# Altium schematic sheet BalEv_ADC_v1_0.SchDoc
size A4; CompanyName: HESSO; Address1: Route du Rawyl 47; Address2: 1950 Sion; Address3: Switzerland; DocumentNumber: 3; SheetNumber: 5; SheetTotal: 8; PageSetup: Record=PageOptions|CenterHorizontal=True|CenterVertical=True|PrintScale=1.00|XCorrection=1.00|YCorrection=1.00|PrintKind=1|BorderSize=5000000|LeftOffset=0|BottomOffset=0|Orientation=2|PaperLength=1000|PaperWidth=1000|Scale=100|PaperSource=15|PrintQuality=1200|MediaType=1|DitherType=10|PrintScaleMode=1|PaperKind=A4|PaperIndex=9; ProjectName: Project Name
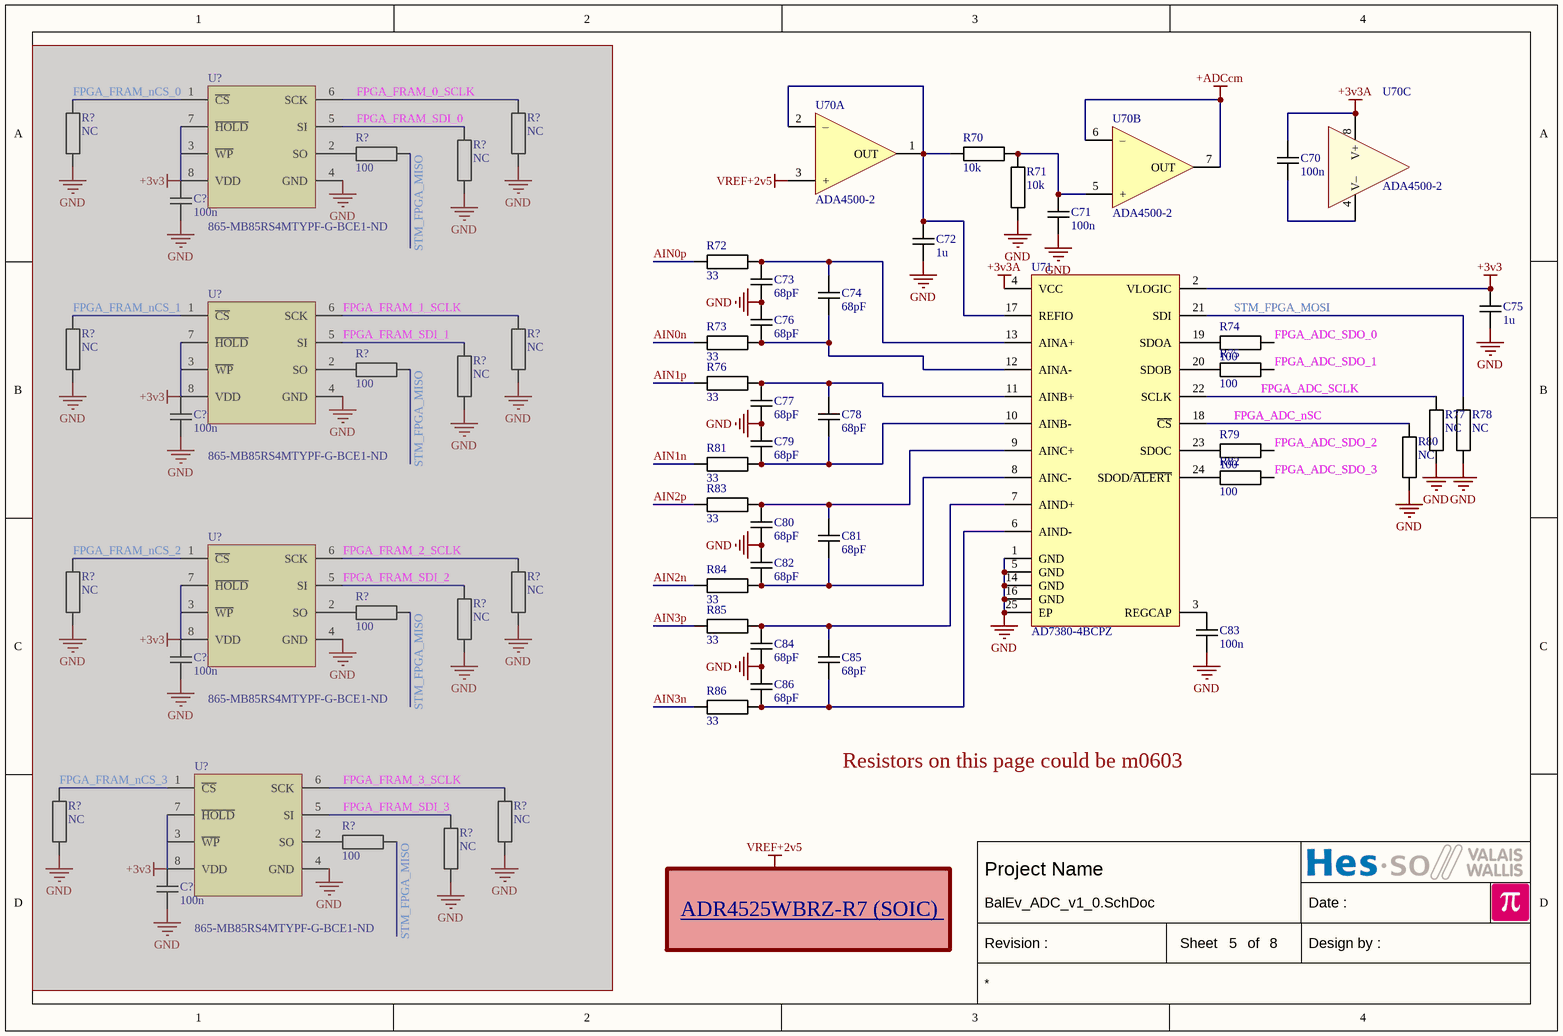
[diagram p0: BalEv_ADC_v1_0.SchDoc]

## Parts
(Parts that share a designator on the sheet are numbered #1, #2 ... from top to bottom, then left to right.)
C70  100n  [CAPACITOR 1005 REFLOW]
C71  100n  [CAPACITOR 1005 REFLOW]
C72  1u  [CAPACITOR 1005 REFLOW]
C73  68pF  [CAPACITOR 1005 REFLOW]
C74  68pF  [CAPACITOR 1005 REFLOW]
C75  1u  [CAPACITOR 1005 REFLOW]
C76  68pF  [CAPACITOR 1005 REFLOW]
C77  68pF  [CAPACITOR 1005 REFLOW]
C78  68pF  [CAPACITOR 1005 REFLOW]
C79  68pF  [CAPACITOR 1005 REFLOW]
C80  68pF  [CAPACITOR 1005 REFLOW]
C81  68pF  [CAPACITOR 1005 REFLOW]
C82  68pF  [CAPACITOR 1005 REFLOW]
C83  100n  [CAPACITOR 1005 REFLOW]
C84  68pF  [CAPACITOR 1005 REFLOW]
C85  68pF  [CAPACITOR 1005 REFLOW]
C86  68pF  [CAPACITOR 1005 REFLOW]
C?#1  100n  [CAPACITOR 1005 REFLOW]  (masked out: inside a compile mask, not in the netlist)
C?#2  100n  [CAPACITOR 1005 REFLOW]  (masked out: inside a compile mask, not in the netlist)
C?#3  100n  [CAPACITOR 1005 REFLOW]  (masked out: inside a compile mask, not in the netlist)
C?#4  100n  [CAPACITOR 1005 REFLOW]  (masked out: inside a compile mask, not in the netlist)
R70  10k  [RESISTOR 1608 REFLOW]
R71  10k  [RESISTOR 1608 REFLOW]
R72  33  [RESISTOR 1005 REFLOW]
R73  33  [RESISTOR 1005 REFLOW]
R74  100  [RESISTOR 1005 REFLOW]
R75  100  [RESISTOR 1005 REFLOW]
R76  33  [RESISTOR 1005 REFLOW]
R77  NC  [RESISTOR 1005 REFLOW]
R78  NC  [RESISTOR 1005 REFLOW]
R79  100  [RESISTOR 1005 REFLOW]
R80  NC  [RESISTOR 1005 REFLOW]
R81  33  [RESISTOR 1005 REFLOW]
R82  100  [RESISTOR 1005 REFLOW]
R83  33  [RESISTOR 1005 REFLOW]
R84  33  [RESISTOR 1005 REFLOW]
R85  33  [RESISTOR 1005 REFLOW]
R86  33  [RESISTOR 1005 REFLOW]
R?#1  100  [RESISTOR 1005 REFLOW]  (masked out: inside a compile mask, not in the netlist)
R?#2  NC  [RESISTOR 1005 REFLOW]  (masked out: inside a compile mask, not in the netlist)
R?#3  NC  [RESISTOR 1005 REFLOW]  (masked out: inside a compile mask, not in the netlist)
R?#4  NC  [RESISTOR 1005 REFLOW]  (masked out: inside a compile mask, not in the netlist)
R?#5  100  [RESISTOR 1005 REFLOW]  (masked out: inside a compile mask, not in the netlist)
R?#6  NC  [RESISTOR 1005 REFLOW]  (masked out: inside a compile mask, not in the netlist)
R?#7  NC  [RESISTOR 1005 REFLOW]  (masked out: inside a compile mask, not in the netlist)
R?#8  NC  [RESISTOR 1005 REFLOW]  (masked out: inside a compile mask, not in the netlist)
R?#9  100  [RESISTOR 1005 REFLOW]  (masked out: inside a compile mask, not in the netlist)
R?#10  NC  [RESISTOR 1005 REFLOW]  (masked out: inside a compile mask, not in the netlist)
R?#11  NC  [RESISTOR 1005 REFLOW]  (masked out: inside a compile mask, not in the netlist)
R?#12  NC  [RESISTOR 1005 REFLOW]  (masked out: inside a compile mask, not in the netlist)
R?#13  100  [RESISTOR 1005 REFLOW]  (masked out: inside a compile mask, not in the netlist)
R?#14  NC  [RESISTOR 1005 REFLOW]  (masked out: inside a compile mask, not in the netlist)
R?#15  NC  [RESISTOR 1005 REFLOW]  (masked out: inside a compile mask, not in the netlist)
R?#16  NC  [RESISTOR 1005 REFLOW]  (masked out: inside a compile mask, not in the netlist)
U70  ADA4500-2  [MSOP8 P0.65 C3.0X3.0 H1.1]  (parts A,B,C of 3)
U71  AD7380-4BCPZ  [QFN24 P0.5 T0.5x0.5 C4.0x4.0 H0.6]
U?#1  865-MB85RS4MTYPF-G-BCE1-ND  [SO8W P1.27 C5.0X5.0 H2.0]  (masked out: inside a compile mask, not in the netlist)
U?#2  865-MB85RS4MTYPF-G-BCE1-ND  [SO8W P1.27 C5.0X5.0 H2.0]  (masked out: inside a compile mask, not in the netlist)
U?#3  865-MB85RS4MTYPF-G-BCE1-ND  [SO8W P1.27 C5.0X5.0 H2.0]  (masked out: inside a compile mask, not in the netlist)
U?#4  865-MB85RS4MTYPF-G-BCE1-ND  [SO8W P1.27 C5.0X5.0 H2.0]  (masked out: inside a compile mask, not in the netlist)

## Nets
+3v3: C75.2 U71.2(VLOGIC)
+3v3A: C70.2 U70.8(V+) U71.4(VCC)
+ADCcm: U70.6(–) U70.7(OUT)
GND: C71.1 C72.1 C73.2 C75.1 C76.1 C77.2 C79.1 C80.2 C82.1 C83.1 C84.2 C86.1 R71.1 R77.1 R78.1 R80.1 U71.1(GND) U71.5(GND) U71.14(GND) U71.16(GND) U71.25(EP)
VREF+2v5: U70.3(+)
AIN0n: R73.1
AIN0p: R72.1
AIN1n: R81.1
AIN1p: R76.1
AIN2n: R84.1
AIN2p: R83.1
AIN3n: R86.1
AIN3p: R85.1
FPGA_ADC_nSC: R80.2 U71.18(~{CS})
FPGA_ADC_SCLK: R77.2 U71.22(SCLK)
FPGA_ADC_SDO_0: R74.2
FPGA_ADC_SDO_1: R75.2
FPGA_ADC_SDO_2: R79.2
FPGA_ADC_SDO_3: R82.2
STM_FPGA_MOSI: R78.2 U71.21(SDI)
NetC70_1: C70.1 U70.4(V–)
NetC71_2: C71.2 R70.2 R71.2 U70.5(+)
NetC72_2: C72.2 R70.1 U70.1(OUT) U70.2(–) U71.17(REFIO)
NetC73_1: C73.1 C74.2 R72.2 U71.13(AINA+)
NetC74_1: C74.1 C76.2 R73.2 U71.12(AINA-)
NetC77_1: C77.1 C78.2 R76.2 U71.11(AINB+)
NetC78_1: C78.1 C79.2 R81.2 U71.10(AINB-)
NetC80_1: C80.1 C81.2 R83.2 U71.9(AINC+)
NetC81_1: C81.1 C82.2 R84.2 U71.8(AINC-)
NetC83_2: C83.2 U71.3(REGCAP)
NetC84_1: C84.1 C85.2 R85.2 U71.7(AIND+)
NetC85_1: C85.1 C86.2 R86.2 U71.6(AIND-)
NetR74_1: R74.1 U71.19(SDOA)
NetR75_1: R75.1 U71.20(SDOB)
NetR79_1: R79.1 U71.23(SDOC)
NetR82_1: R82.1 U71.24(SDOD/~{ALERT})

## Notes on the sheet
- Resistors on this page could be m0603
- ADR4525WBRZ-R7 (SOIC) <https://www.analog.com/media/en/technical-documentation/data-sheets/ADR4520_4525_4530_4533_4540_4550.pdf>
- Labels drawn without touching a wire or pin: VREF+2v5
- Date :
- Revision :
- Sheet
- of
- Design by :

## Library data of the parts
C70-C86 C?#1-C?#4 = Capacitor
  C70 C71 C83 C?#1-C?#4: Value: 100n
  C72 C75: Value: 1u
  C73 C74 C76-C82 C84-C86: Value: 68pF
R70 R71 = Resistor: Resistor 0.01% (RNCF0603TKW10K0); Value: 10k
R72-R86 R?#1-R?#16 = Resistor
  R72 R73 R76 R81 R83-R86: Value: 33
  R74 R75 R79 R82 R?#1 R?#5 R?#9 R?#13: Value: 100
  R77 R78 R80 R?#2-R?#4 R?#6-R?#8 R?#10-R?#12 R?#14-R?#16: Value: NC
U70 = OPA DUAL: Generic dual OPA 8 pins; Value: ADA4500-2
U71 = AD7380-4BCPZ: Differential Input, Quad, External Reference / Simultaneous Sampling, 16-Bit, SAR ADC; Value: AD7380-4BCPZ
U?#1-U?#4 = FM25V20A-G: 2-Mbit (256 K × 8) Serial (SPI) F-RAM; Value: 865-MB85RS4MTYPF-G-BCE1-ND